# Altium schematic sheet RFID Schematic.SchDoc
size A4
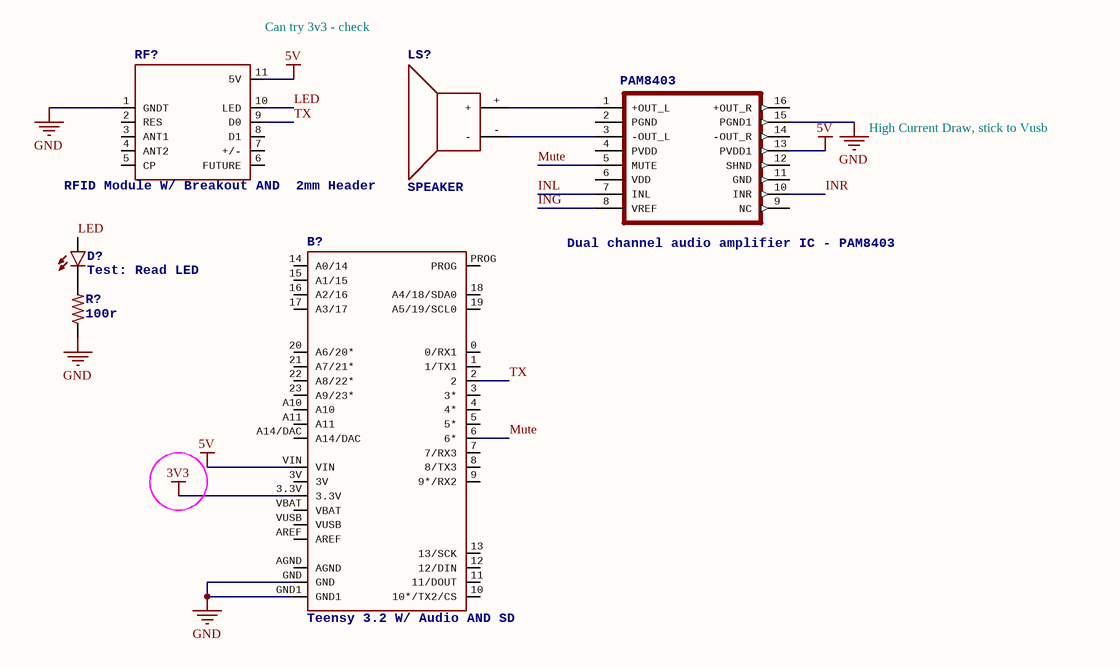
[diagram p0: RFID Schematic.SchDoc]

## Parts
B?  Teensy 3.2 W/ Audio AND SD  [TEENSY-3.1]
D?  Test: Read LED  [LED_5MM-KIT]
LS?  SPEAKER  [PCB_MOUNT_SPEAKER]
PAM8403  Dual channel audio amplifier IC - PAM8403  [SOP-16]
R?  100r  [AXIAL-0.3]
RF?  RFID Module W/ Breakout AND  2mm Header  [ID-12]

## Nets
3V3: B?.3.3V
5V: B?.VIN PAM8403.13(PVDD1) RF?.11(5V)
GND: B?.GND B?.GND1 PAM8403.15(PGND1) R?.P$1 RF?.1(GNDT)
ING: PAM8403.8(VREF)
INL: PAM8403.7(INL)
INR: PAM8403.10(INR)
LED: D?.A RF?.10(LED)
Mute: B?.6(6*) PAM8403.5(MUTE)
TX: B?.2 RF?.9(D0)
NetD?_K: D?.K(C) R?.P$2
NetLS?_+: LS?.+ PAM8403.1(+OUT_L)
NetLS?_-: LS?.- PAM8403.3(-OUT_L)

Not connected (* = marked no-connect by the designer): B? 0(0/RX1) 1(1/TX1) 3(3*) 3V 4(4*) 5(5*) 7(7/RX3) 8(8/TX3) 9(9*/RX2) 10(10*/TX2/CS) 11(11/DOUT) 12(12/DIN) 13(13/SCK) 14(A0/14) 15(A1/15) 16(A2/16) 17(A3/17) 18(A4/18/SDA0) 19(A5/19/SCL0) 20(A6/20*) 21(A7/21*) 22(A8/22*) 23(A9/23*) A10 A11 A14/DAC AGND AREF PROG VBAT VUSB; PAM8403 2(PGND) 4(PVDD) 6(VDD) 9(NC) 11(GND) 12(SHND) 14(-OUT_R) 16(+OUT_R); RF? 2(RES) 3(ANT1) 4(ANT2) 5(CP) 6(FUTURE) 7(+/-) 8(D1)

## Notes on the sheet
- (near RF?) Can try 3v3 - check
- High Current Draw, stick to Vusb

## Library data of the parts
B? = TEENSY-3.1SILK: SF_ID: DEV-12646
D? = LED5MM-KIT
LS? = SPEAKER: PROD_ID: COMP-11789; SF_SKU: COM-11089
PAM8403 = PAM8403
R? = 100OHM-HORIZ-1/4W-1%: PROD_ID: RES-12181
RF? = ID-12/20: PROD_ID: CONN-08875